# EAGLE schematic schematic (EAGLE 9.7.0)
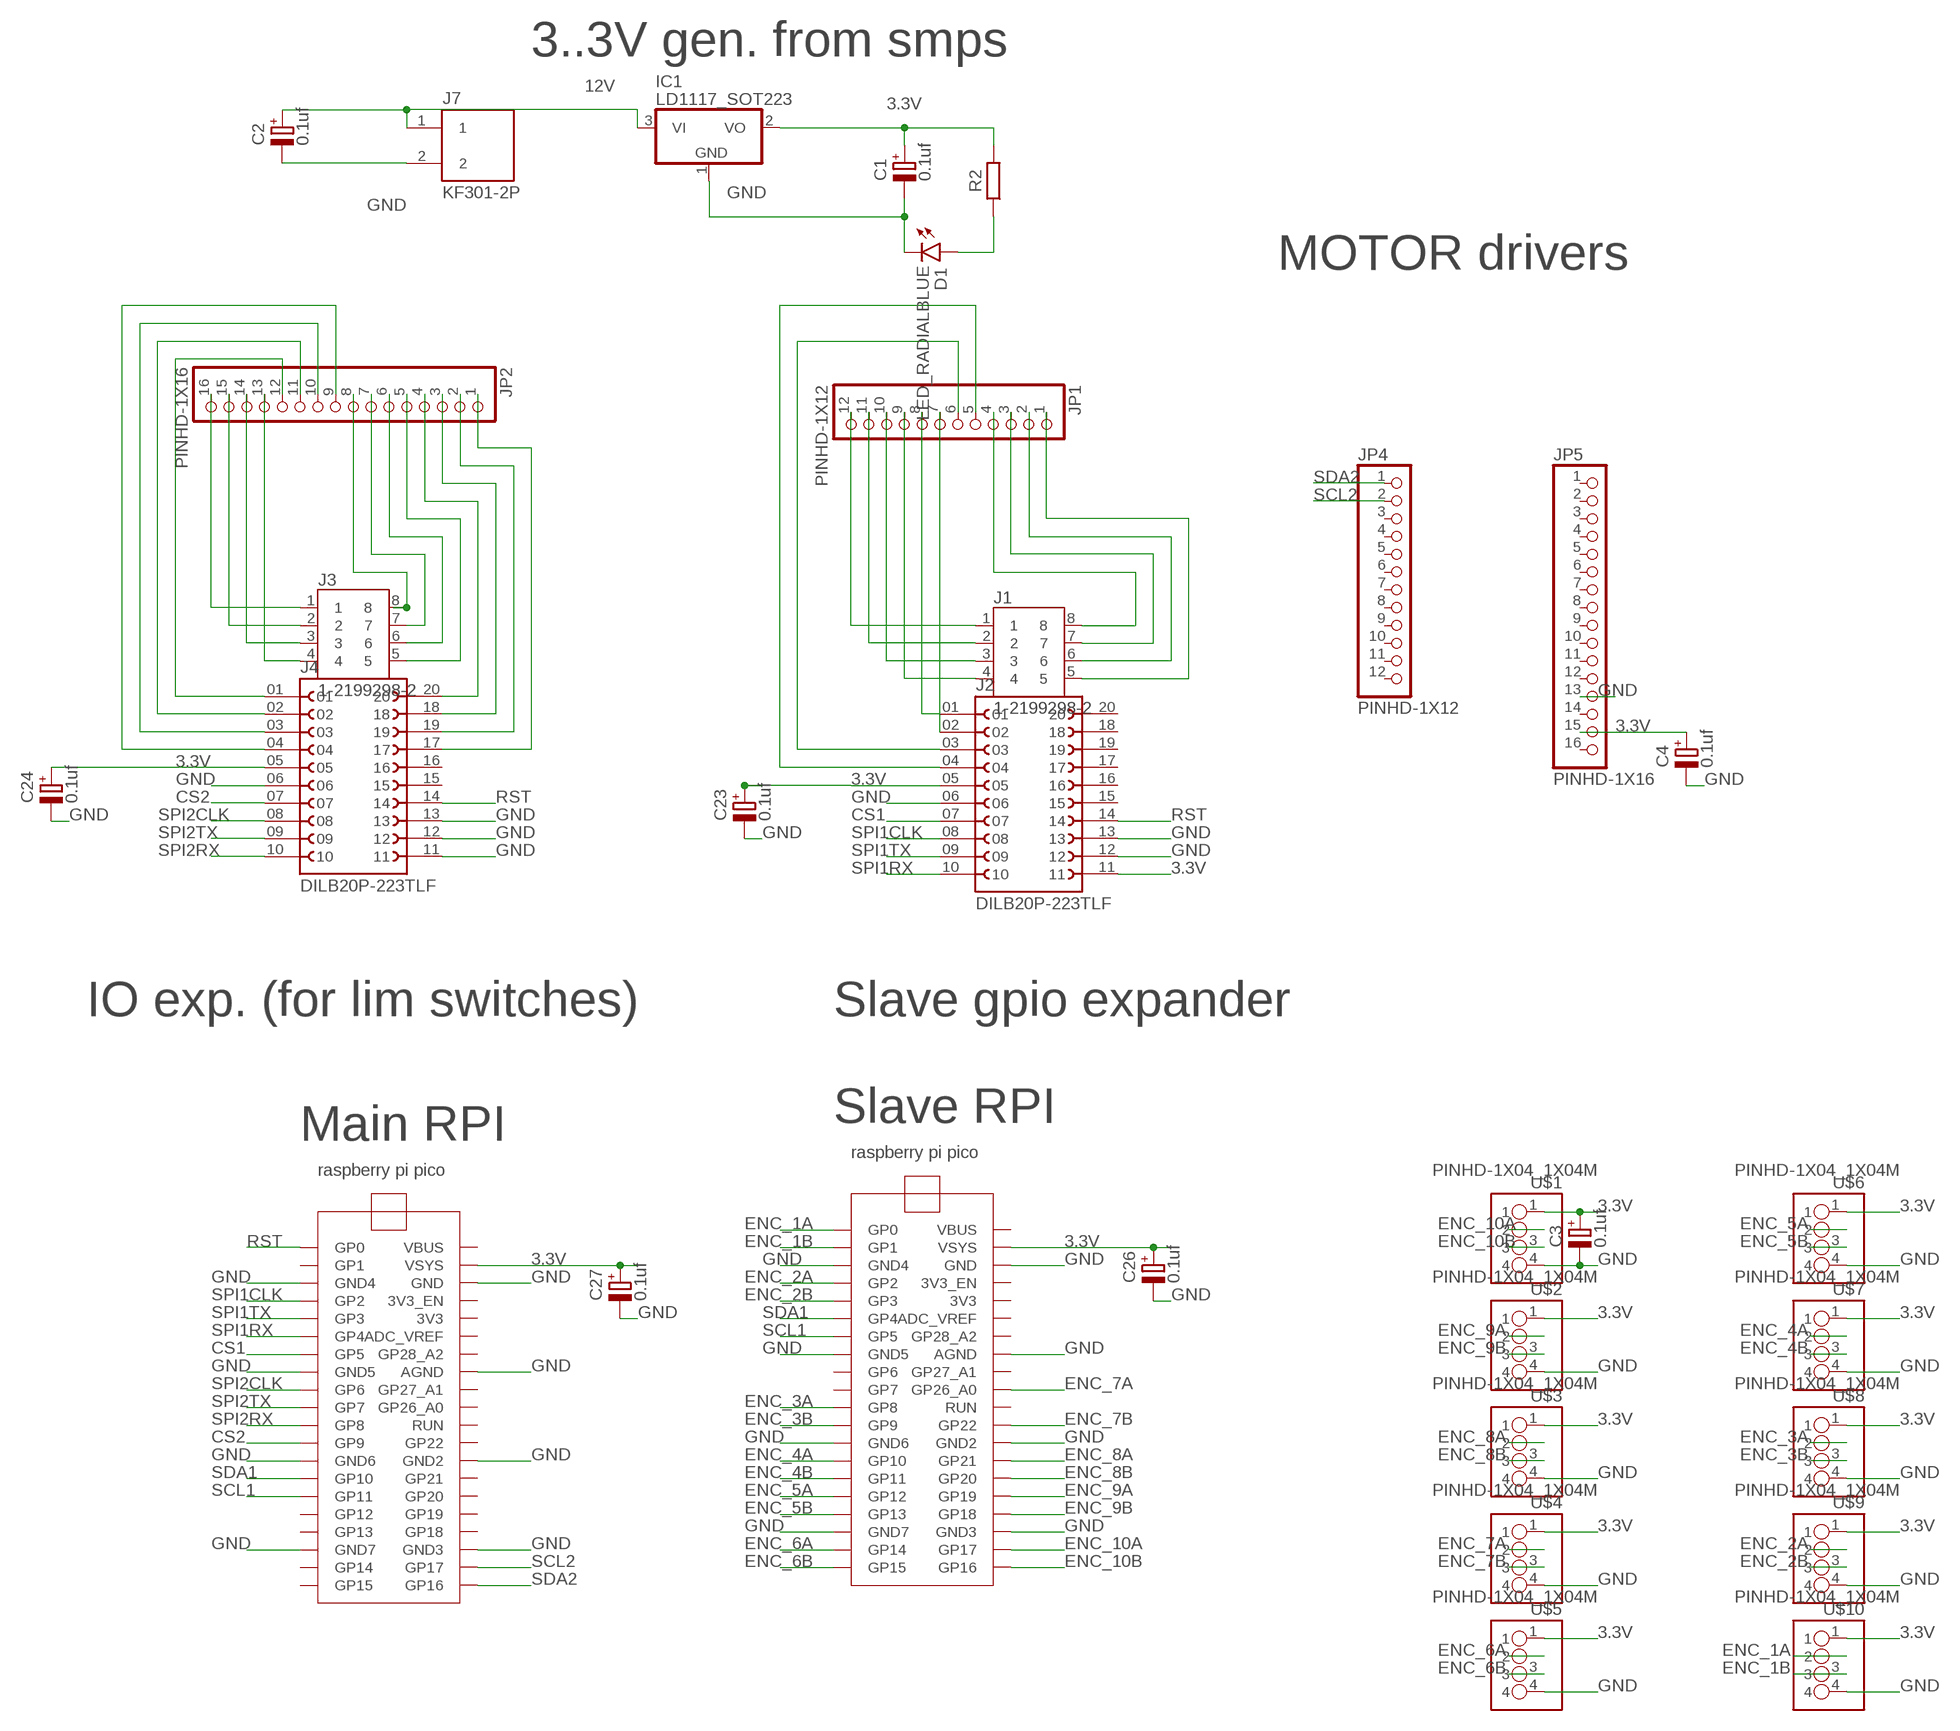
[diagram p0: schematic, sheet 1]

## Parts
C1  0.1uf  CAPACITOR-POLRADIAL-5MM-DIA  [CAPPRD254W65D500H1150B]
C2  0.1uf  CAPACITOR-POLRADIAL-5MM-DIA  [CAPPRD254W65D500H1150B]
C3  0.1uf  CAPACITOR-POLRADIAL-5MM-DIA  [CAPPRD254W65D500H1150B]
C4  0.1uf  CAPACITOR-POLRADIAL-5MM-DIA  [CAPPRD254W65D500H1150B]
C23  0.1uf  CAPACITOR-POLRADIAL-5MM-DIA  [CAPPRD254W65D500H1150B]
C24  0.1uf  CAPACITOR-POLRADIAL-5MM-DIA  [CAPPRD254W65D500H1150B]
C26  0.1uf  CAPACITOR-POLRADIAL-5MM-DIA  [CAPPRD254W65D500H1150B]
C27  0.1uf  CAPACITOR-POLRADIAL-5MM-DIA  [CAPPRD254W65D500H1150B]
D1  LED_RADIALBLUE  [LEDRD254W60D565H860B_B]
IC1  LD1117_SOT223  [SOT230P700X170-4]
J1  1-2199298-2  [TE_1-2199298-2]
J2  DILB20P-223TLF  [AMPHENOL_DILB20P-223TLF]
J3  1-2199298-2  [TE_1-2199298-2]
J4  DILB20P-223TLF  [AMPHENOL_DILB20P-223TLF]
J7  KF301-2P  [HANDSON_KF301-2P]
JP1  PINHD-1X12  [1X12]
JP2  PINHD-1X16  [1X16]
JP4  PINHD-1X12  [1X12]
JP5  PINHD-1X16  [1X16]
R2  R_AXIAL-11.7MM-PITCH  [RESAD1176W63L850D250B]
U2  RASPBERRY_PI_PICO  [RASPBERRY_PI_PICO]
U3  RASPBERRY_PI_PICO  [RASPBERRY_PI_PICO]
U$1  PINHD-1X04_1X04M  [1X04]
U$2  PINHD-1X04_1X04M  [1X04]
U$3  PINHD-1X04_1X04M  [1X04]
U$4  PINHD-1X04_1X04M  [1X04]
U$5  PINHD-1X04_1X04M  [1X04]
U$6  PINHD-1X04_1X04M  [1X04]
U$7  PINHD-1X04_1X04M  [1X04]
U$8  PINHD-1X04_1X04M  [1X04]
U$9  PINHD-1X04_1X04M  [1X04]
U$10  PINHD-1X04_1X04M  [1X04]

## Nets
3.3V: C1.1(+) C3.1(+) C4.1(+) C23.1(+) C24.1(+) C26.1(+) C27.1(+) IC1.2(VO) J2.05 J2.11 J4.05 JP5.15 R2.2 U2.VSYS U3.VSYS U$1.1 U$2.1 U$3.1 U$4.1 U$5.1 U$6.1 U$7.1 U$8.1 U$9.1 U$10.1
12V: C2.1(+) IC1.3(VI) J7.1
CS1: J2.07 U2.GP5
CS2: J4.07 U2.GP9
ENC_1A: U3.GP0 U$10.2
ENC_1B: U3.GP1 U$10.3
ENC_2A: U3.GP2 U$9.2
ENC_2B: U3.GP3 U$9.3
ENC_3A: U3.GP8 U$8.2
ENC_3B: U3.GP9 U$8.3
ENC_4A: U3.GP10 U$7.2
ENC_4B: U3.GP11 U$7.3
ENC_5A: U3.GP12 U$6.2
ENC_5B: U3.GP13 U$6.3
ENC_6A: U3.GP14 U$5.2
ENC_6B: U3.GP15 U$5.3
ENC_7A: U3.GP26_A0 U$4.2
ENC_7B: U3.GP22 U$4.3
ENC_8A: U3.GP21 U$3.2
ENC_8B: U3.GP20 U$3.3
ENC_9A: U3.GP19 U$2.2
ENC_9B: U3.GP18 U$2.3
ENC_10A: U3.GP17 U$1.2
ENC_10B: U3.GP16 U$1.3
GND: C1.2(-) C2.2(-) C3.2(-) C4.2(-) C23.2(-) C24.2(-) C26.2(-) C27.2(-) D1.C IC1.1(GND) J2.06 J2.12 J2.13 J4.06 J4.11 J4.12 J4.13 J7.2 JP5.13 U2.AGND U2.GND U2.GND2 U2.GND3 U2.GND4 U2.GND5 U2.GND6 U2.GND7 U3.AGND U3.GND U3.GND2 U3.GND3 U3.GND4 U3.GND5 U3.GND6 U3.GND7 U$1.4 U$2.4 U$3.4 U$4.4 U$5.4 U$6.4 U$7.4 U$8.4 U$9.4 U$10.4
GPA1: J3.8 JP2.8
LS1: J1.5 JP1.1
N$1: D1.A R2.1
N$2: J1.1 JP1.12
N$3: J1.2 JP1.11
N$4: J1.3 JP1.10
N$5: J1.4 JP1.9
N$6: J2.01 JP1.8
N$7: J1.8 JP1.4
N$8: J1.7 JP1.3
N$9: J2.02 JP1.7
N$10: J2.03 JP1.6
N$11: J2.04 JP1.5
N$12: J3.1 JP2.16
N$13: J3.2 JP2.15
N$14: J3.3 JP2.14
N$15: J3.4 JP2.13
N$16: J4.01 JP2.12
N$17: J1.6 JP1.2
N$18: J4.02 JP2.11
N$19: J4.03 JP2.10
N$20: J4.04 JP2.9
N$24: J3.7 JP2.7
N$25: J3.6 JP2.6
N$26: J3.5 JP2.5
N$27: J4.20 JP2.4
N$28: J4.18 JP2.3
N$33: J4.19 JP2.2
N$34: J4.17 JP2.1
RST: J2.14 J4.14 U2.GP0
SCL1: U2.GP11 U3.GP5
SCL2: JP4.2 U2.GP17
SDA1: U2.GP10 U3.GP4
SDA2: JP4.1 U2.GP16
SPI1CLK: J2.08 U2.GP2
SPI1RX: J2.10 U2.GP4
SPI1TX: J2.09 U2.GP3
SPI2CLK: J4.08 U2.GP6
SPI2RX: J4.10 U2.GP8
SPI2TX: J4.09 U2.GP7
Unconnected: J2.15 J2.16 J2.17 J2.18 J2.19 J2.20 J4.15 J4.16 JP4.3 JP4.4 JP4.5 JP4.6 JP4.7 JP4.8 JP4.9 JP4.10 JP4.11 JP4.12 JP5.1 JP5.2 JP5.3 JP5.4 JP5.5 JP5.6 JP5.7 JP5.8 JP5.9 JP5.10 JP5.11 JP5.12 JP5.14 JP5.16 U2.3V3 U2.3V3_EN U2.ADC_VREF U2.GP1 U2.GP12 U2.GP13 U2.GP14 U2.GP15 U2.GP18 U2.GP19 U2.GP20 U2.GP21 U2.GP22 U2.GP26_A0 U2.GP27_A1 U2.GP28_A2 U2.RUN U2.VBUS U3.3V3 U3.3V3_EN U3.ADC_VREF U3.GP6 U3.GP7 U3.GP27_A1 U3.GP28_A2 U3.RUN U3.VBUS

## Notes on the sheet
- 3..3V gen. from smps
- MOTOR drivers
- IO exp. (for lim switches) | Slave gpio expander
- Slave RPI
- Main RPI

## Library data of the parts
C1-C4 C23 C24 C26 C27 = Tinkercad:CAPACITOR-POL: Capacitor Polarised - Generic
D1 = Opto-Electronic:LED_RADIAL: LED - Generic
IC1 = Tinkercad:LD1117: LM2937-2.5, LM2937-3.3 400mA and 500mA Voltage Regulators Source: http://cache.national.com/ds/LM/LM2937-2.5.pdf
J1 J3 = 1-2199298-2:1-2199298-2: Check availability <https://pricing.snapeda.com/parts/1-2199298-2/TE%20Connectivity/view-part?ref=eda>; AVAILABILITY: In Stock; CHECK_PRICES: https://www.snapeda.com/parts/1-2199298-2/TE+Connectivity+AMP+Connectors/view-part/?ref=eda; COMMENT: 1-2199298-2; DESCRIPTION: CONN IC DIP SOCKET 8POS TIN / 8 (2 x 4) Pos DIP, 0.3 (7.62mm) Row Spacing Socket Tin Through Hole; MF: TE Connectivity; MP: 1-2199298-2; PACKAGE: PDIP-8 TE Connectivity; PRICE: None; SNAPEDA_LINK: https://www.snapeda.com/parts/1-2199298-2/TE+Connectivity+AMP+Connectors/view-part/?ref=snap
J2 J4 = DILB20P-223TLF:DILB20P-223TLF: Check availability <https://pricing.snapeda.com/parts/DILB20P-223TLF/FCI%20Connectors/view-part?ref=eda>; AVAILABILITY: In Stock; CHECK_PRICES: https://www.snapeda.com/parts/DILB20P-223TLF/Amphenol/view-part/?ref=eda; DESCRIPTION: 20 (2 x 10) Pos DIP, 0.3 (7.62mm) Row Spacing Socket Tin Through Hole; MF: FCI Connectors; MP: DILB20P-223TLF; PACKAGE: None; PRICE: None; SNAPEDA_LINK: https://www.snapeda.com/parts/DILB20P-223TLF/Amphenol/view-part/?ref=snap
J7 = KF301-2P:KF301-2P: 2 Pin Terminal Block 5mm Pitch Check availability <https://pricing.snapeda.com/parts/KF301-2P/Handson%20Technology/view-part?ref=eda>; AVAILABILITY: Not in stock; CHECK_PRICES: https://www.snapeda.com/parts/KF301-2P/Handson+Technology/view-part/?ref=eda; DESCRIPTION: 2 Pin Terminal Block 5mm Pitch; MF: Handson Technology; MP: KF301-2P; PACKAGE: None; PRICE: None; SNAPEDA_LINK: https://www.snapeda.com/parts/KF301-2P/Handson+Technology/view-part/?ref=snap
JP1 JP4 = Connector:PINHD-1X12: PIN HEADER; CATEGORY: Headers; DESCRIPTION: Header, Straight, 12 Position; MANUFACTURER: Generic; MPN: Generic; OPERATING_TEMPERATURE: Generic; PART_STATUS: Active; PITCH: 0.100" (2.54mm); ROHS_COMPLIANCE: Generic; SERIES: Generic; SUB-CATEGORY: Headers, Male Pins; TYPE: Board to Board or Cable, Unshrouded, Through Hole, Straight
JP2 JP5 = Connector:PINHD-1X16: PIN HEADER; CATEGORY: Headers; DESCRIPTION: Header, Straight, 16 Position; MANUFACTURER: Generic; MPN: Generic; OPERATING_TEMPERATURE: Generic; PART_STATUS: Active; PITCH: 0.100" (2.54mm); ROHS_COMPLIANCE: Generic; SERIES: Generic; SUB-CATEGORY: Headers, Male Pins; TYPE: Board to Board or Cable, Unshrouded, Through Hole, Straight
R2 = Resistor:R: Resistor Fixed - Generic; CATEGORY: Resistor; SUB-CATEGORY: Fixed
U2 U3 = RASPBERRY_PI_PICO:RASPBERRY_PI_PICO: Check availability <https://pricing.snapeda.com/parts/RASPBERRY%20PI%20PICO/Raspberry%20Pi/view-part?ref=eda>; AVAILABILITY: In Stock; CHECK_PRICES: https://www.snapeda.com/parts/RASPBERRY%20PI%20PICO/Raspberry+Pi/view-part/?ref=eda; DESCRIPTION: Raspberry Pi Board, Arm Cortex-M0+; Core Architecture:Arm; Core Sub-Architecture:Cortex-M0+; Kit Contents:Raspberry Pi Pico Board; No. Of Bits:32Bit; Silicon Core Number:Rp2040; Silicon Manufacturer:Raspberry Pi |Raspberry-Pi RASPBERRY PI PICO; MF: Raspberry Pi; MP: RASPBERRY PI PICO; PACKAGE: None; PRICE: None; SNAPEDA_LINK: https://www.snapeda.com/parts/RASPBERRY%20PI%20PICO/Raspberry+Pi/view-part/?ref=snap
U$1-U$10 = Tinkercad:PINHD-1X04